# EAGLE schematic cpu2 (EAGLE 7.2.0)
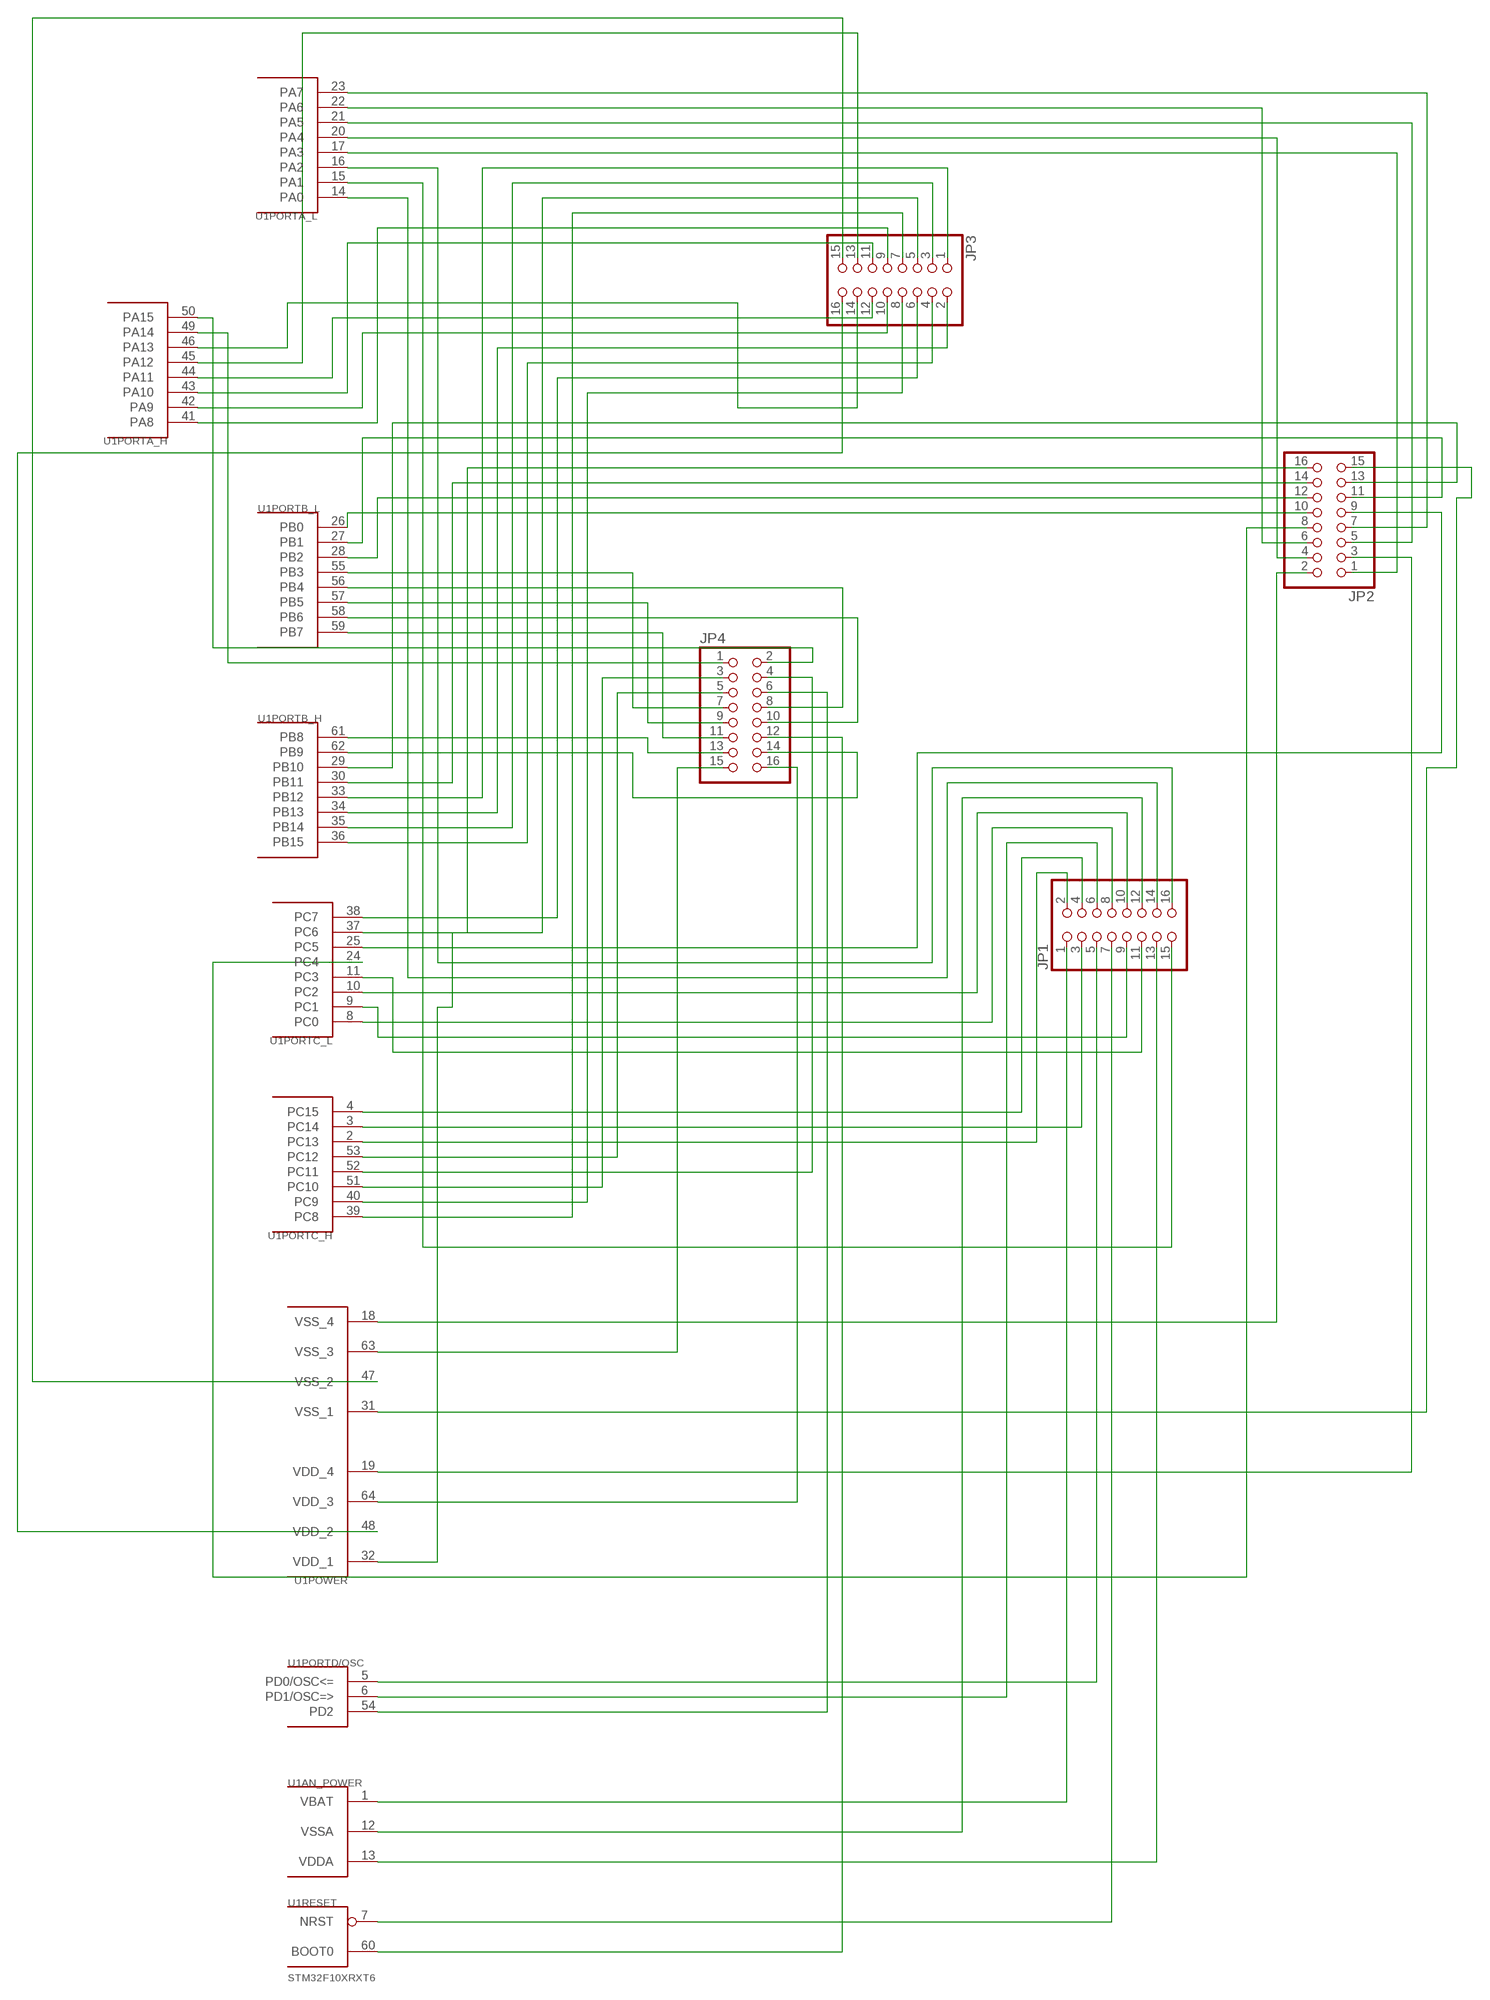
[diagram p0: schematic, sheet 1]

## Parts
JP1  PINHD-2X8  [2X08]
JP2  PINHD-2X8  [2X08]
JP3  PINHD-2X8  [2X08]
JP4  PINHD-2X8  [2X08]
U1  STM32F10XRXT6  [TQFP64]

## Nets
N$1: JP1.1 U1.1(AN_POWER:VBAT)
N$2: JP1.2 U1.2(PORTC_H:PC13)
N$3: JP1.3 U1.3(PORTC_H:PC14)
N$4: JP1.4 U1.4(PORTC_H:PC15)
N$5: JP1.5 U1.5(PORTD/OSC:PD0/OSC<=)
N$6: JP1.6 U1.6(PORTD/OSC:PD1/OSC=>)
N$7: JP1.7 U1.7(RESET:NRST)
N$8: JP1.8 U1.8(PORTC_L:PC0)
N$9: JP1.9 U1.9(PORTC_L:PC1)
N$10: JP1.10 U1.10(PORTC_L:PC2)
N$11: JP1.11 U1.11(PORTC_L:PC3)
N$12: JP1.12 U1.12(AN_POWER:VSSA)
N$13: JP1.13 U1.13(AN_POWER:VDDA)
N$14: JP1.14 U1.14(PORTA_L:PA0)
N$15: JP1.15 U1.15(PORTA_L:PA1)
N$16: JP1.16 U1.16(PORTA_L:PA2)
N$17: JP2.1 U1.17(PORTA_L:PA3)
N$18: JP2.2 U1.18(POWER:VSS_4)
N$19: JP2.3 U1.19(POWER:VDD_4)
N$20: JP2.4 U1.20(PORTA_L:PA4)
N$21: JP2.5 U1.21(PORTA_L:PA5)
N$22: JP2.6 U1.22(PORTA_L:PA6)
N$23: JP2.7 U1.23(PORTA_L:PA7)
N$24: JP2.8 U1.24(PORTC_L:PC4)
N$25: JP2.9 U1.25(PORTC_L:PC5)
N$26: JP2.10 U1.26(PORTB_L:PB0)
N$27: JP2.11 U1.27(PORTB_L:PB1)
N$28: JP2.12 U1.28(PORTB_L:PB2)
N$29: JP2.13 U1.29(PORTB_H:PB10)
N$30: JP2.14 U1.30(PORTB_H:PB11)
N$31: JP2.15 U1.31(POWER:VSS_1)
N$32: JP2.16 U1.32(POWER:VDD_1)
N$33: JP3.1 U1.33(PORTB_H:PB12)
N$34: JP3.2 U1.34(PORTB_H:PB13)
N$35: JP3.3 U1.35(PORTB_H:PB14)
N$36: JP3.4 U1.36(PORTB_H:PB15)
N$37: JP3.5 U1.37(PORTC_L:PC6)
N$38: JP3.6 U1.38(PORTC_L:PC7)
N$39: JP3.7 U1.39(PORTC_H:PC8)
N$40: JP3.8 U1.40(PORTC_H:PC9)
N$41: JP3.9 U1.41(PORTA_H:PA8)
N$42: JP3.10 U1.42(PORTA_H:PA9)
N$43: JP3.11 U1.43(PORTA_H:PA10)
N$44: JP3.12 U1.44(PORTA_H:PA11)
N$45: JP3.13 U1.45(PORTA_H:PA12)
N$46: JP3.14 U1.46(PORTA_H:PA13)
N$47: JP3.15 U1.47(POWER:VSS_2)
N$48: JP3.16 U1.48(POWER:VDD_2)
N$49: JP4.1 U1.49(PORTA_H:PA14)
N$50: JP4.2 U1.50(PORTA_H:PA15)
N$51: JP4.3 U1.51(PORTC_H:PC10)
N$52: JP4.4 U1.52(PORTC_H:PC11)
N$53: JP4.5 U1.53(PORTC_H:PC12)
N$54: JP4.6 U1.54(PORTD/OSC:PD2)
N$55: JP4.7 U1.55(PORTB_L:PB3)
N$56: JP4.8 U1.56(PORTB_L:PB4)
N$57: JP4.9 U1.57(PORTB_L:PB5)
N$58: JP4.10 U1.58(PORTB_L:PB6)
N$59: JP4.11 U1.59(PORTB_L:PB7)
N$60: JP4.12 U1.60(RESET:BOOT0)
N$61: JP4.13 U1.61(PORTB_H:PB8)
N$62: JP4.14 U1.62(PORTB_H:PB9)
N$63: JP4.15 U1.63(POWER:VSS_3)
N$64: JP4.16 U1.64(POWER:VDD_3)

## Library data of the parts
JP1-JP4 = pinhead:PINHD-2X8: PIN HEADER
U1 = stm32:STM32F10XRXT6: STM32F101/103 64pin LQFP